# EAGLE design T08-TxClicker-Rev1a (EAGLE 6.4)
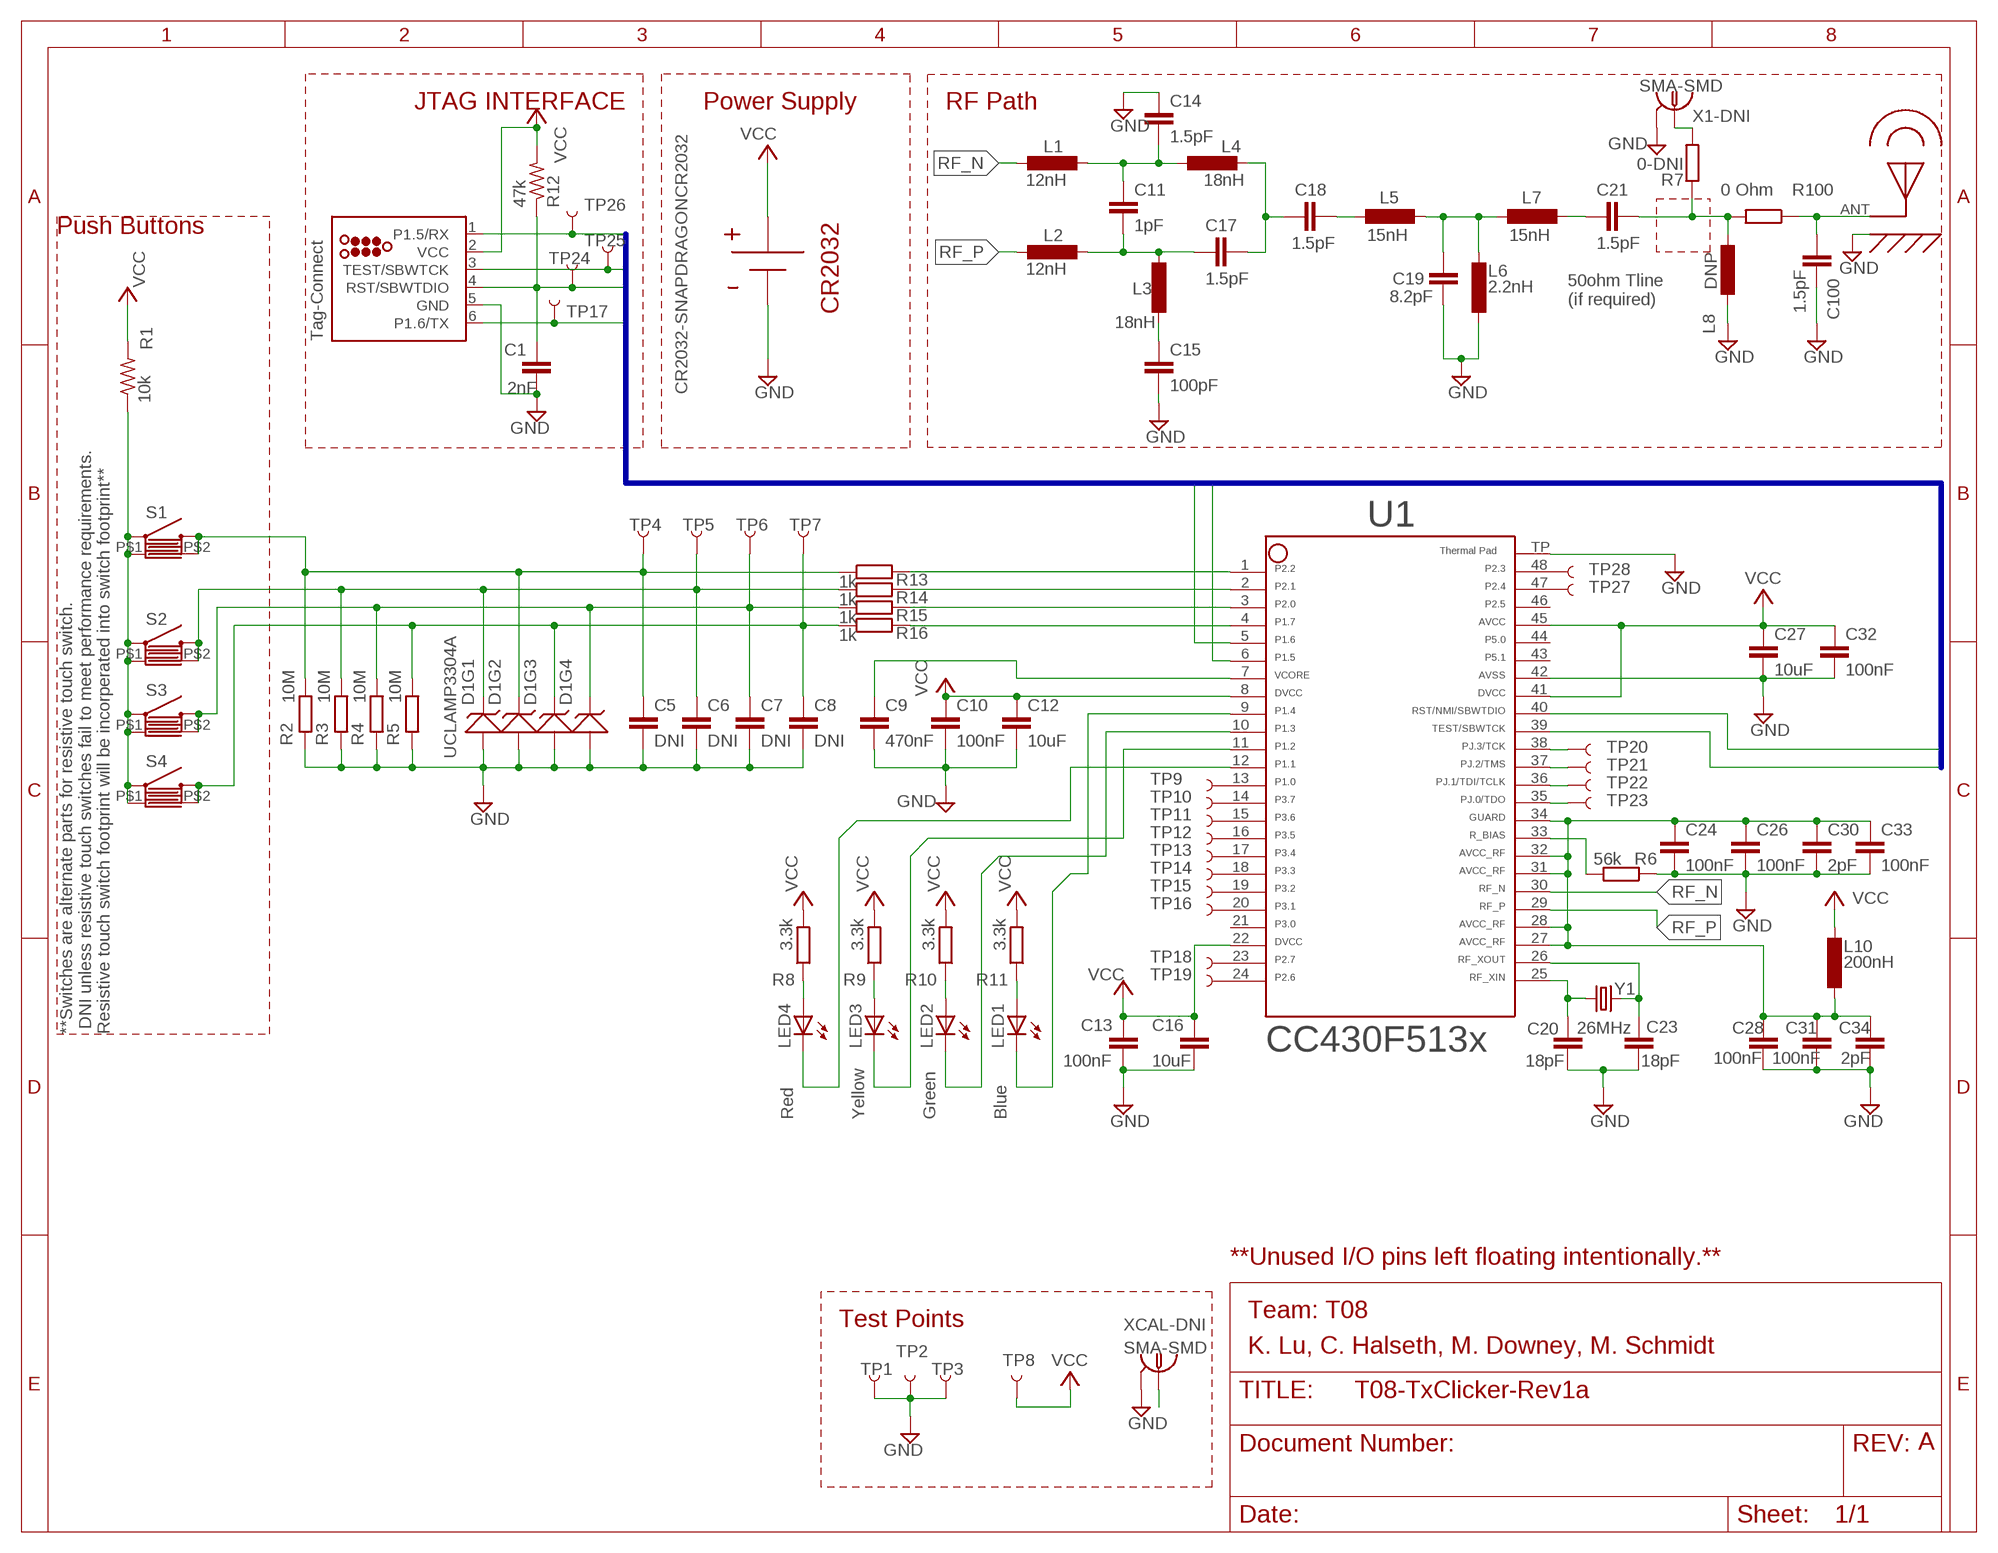
[diagram p0: schematic, sheet 1]

## Parts
C1  2nF  C0603  [C0603]
C5  DNI  C0603  [C0603]
C6  DNI  C0603  [C0603]
C7  DNI  C0603  [C0603]
C8  DNI  C0603  [C0603]
C9  470nF  C0603  [C0603]
C10  100nF  C0603  [C0603]
C11  1pF  C0402  [C0402]
C12  10uF  C0603  [C0603]
C13  100nF  C0603  [C0603]
C14  1.5pF  C0402  [C0402]
C15  100pF  C0402  [C0402]
C16  10uF  C0603  [C0603]
C17  1.5pF  C0402  [C0402]
C18  1.5pF  C0402  [C0402]
C19  8.2pF  C0402  [C0402]
C20  18pF  C0603  [C0603]
C21  1.5pF  C0402  [C0402]
C23  18pF  C0603  [C0603]
C24  100nF  C0603  [C0603]
C26  100nF  C0603  [C0603]
C27  10uF  C0603  [C0603]
C28  100nF  C0603  [C0603]
C30  2pF  C0603  [C0603]
C31  100nF  C0603  [C0603]
C32  100nF  C0603  [C0603]
C33  100nF  C0603  [C0603]
C34  2pF  C0603  [C0603]
C100  1.5pF  C0402  [C0402]
D1  UCLAMP3304A  [SOT666]
L1  12nH  LL0402  [L0402]
L2  12nH  LL0402  [L0402]
L3  18nH  LL0402  [L0402]
L4  18nH  LL0402  [L0402]
L5  15nH  LL0402  [L0402]
L6  2.2nH  LL0402  [L0402]
L7  15nH  LL0402  [L0402]
L8  DNP  LL0402  [L0402]
L10  200nH  LL0603  [L0603]
LED1  Blue  LEDCHIP-LED0603  [CHIP-LED0603]
LED2  Green  LEDCHIP-LED0603  [CHIP-LED0603]
LED3  Yellow  LEDCHIP-LED0603  [CHIP-LED0603]
LED4  Red  LEDCHIP-LED0603  [CHIP-LED0603]
R1  10k  R-US_R0603  [R0603]
R2  10M  R0603  [R0603]
R3  10M  R0603  [R0603]
R4  10M  R0603  [R0603]
R5  10M  R0603  [R0603]
R6  56k  R0603  [R0603]
R7  0-DNI  R0603  [R0603]
R8  3.3k  R0603  [R0603]
R9  3.3k  R0603  [R0603]
R10  3.3k  R0603  [R0603]
R11  3.3k  R0603  [R0603]
R12  47k  R-US_R0603  [R0603]
R13  1k  R0603  [R0603]
R14  1k  R0603  [R0603]
R15  1k  R0603  [R0603]
R16  1k  R0603  [R0603]
R100  0 Ohm  R0402  [R0402]
S1  TOUCHPAD_SWITCH_COMBOSWITC_TOUCHPAD  [TACTILE-PTH-12MM]
S2  TOUCHPAD_SWITCH_COMBOSWITC_TOUCHPAD  [TACTILE-PTH-12MM]
S3  TOUCHPAD_SWITCH_COMBOSWITC_TOUCHPAD  [TACTILE-PTH-12MM]
S4  TOUCHPAD_SWITCH_COMBOSWITC_TOUCHPAD  [TACTILE-PTH-12MM]
TP1  TEST-POINT3  [PAD.03X.03]
TP2  TEST-POINT3  [PAD.03X.03]
TP3  TEST-POINT3  [PAD.03X.03]
TP4  TEST-POINT3  [PAD.03X.03]
TP5  TEST-POINT3  [PAD.03X.03]
TP6  TEST-POINT3  [PAD.03X.03]
TP7  TEST-POINT3  [PAD.03X.03]
TP8  TEST-POINT3  [PAD.03X.03]
TP9  TP9  TEST-POINT3  [PAD.03X.03]
TP10  TEST-POINT3  [PAD.03X.03]
TP11  TEST-POINT3  [PAD.03X.03]
TP12  TEST-POINT3  [PAD.03X.03]
TP13  TEST-POINT3  [PAD.03X.03]
TP14  TEST-POINT3  [PAD.03X.03]
TP15  TEST-POINT3  [PAD.03X.03]
TP16  TEST-POINT3  [PAD.03X.03]
TP17  TEST-POINT3  [PAD.03X.03]
TP18  TEST-POINT3  [PAD.03X.03]
TP19  TEST-POINT3  [PAD.03X.03]
TP20  TEST-POINT3  [PAD.03X.03]
TP21  TEST-POINT3  [PAD.03X.03]
TP22  TEST-POINT3  [PAD.03X.03]
TP23  TEST-POINT3  [PAD.03X.03]
TP24  TEST-POINT3  [PAD.03X.03]
TP25  TEST-POINT3  [PAD.03X.03]
TP26  TEST-POINT3  [PAD.03X.03]
TP27  TEST-POINT3  [PAD.03X.03]
TP28  TEST-POINT3  [PAD.03X.03]
U1  CC430F513X---RGZ48  [RGZ48]
U$1  TC2030-MCP  [TC2030-MCP]
U$5  CR2032-SNAPDRAGONCR2032  [CR2032-SNAPDRAGON]
U$6  PCB_ANTENNA_915MHZOSHP  [PCB_ANTENNA_915MHZ]
X1-DNI  SMA-SMD  [SMA-SMD]
XCAL-DNI  SMA-SMD  [SMA-SMD]
Y1  26MHz  CRYSTALTXC-7A  [CRYSTAL-TXC-7A]

## Nets
ANTENNA: C100.P$2 R100.P$1 U$6.ANT
GND: C1.2 C5.2 C6.2 C7.2 C8.2 C9.2 C10.2 C12.2 C13.2 C14.P$1 C15.P$2 C16.2 C19.P$1 C20.2 C23.2 C24.2 C26.2 C27.2 C28.2 C30.2 C31.2 C32.2 C33.2 C34.2 C100.P$1 D1.2 D1.5 L6.P$2 L8.P$1 R2.1 R3.1 R4.1 R5.1 R6.1 TP1.P$1 TP2.P$1 TP3.P$1 U1.42 U1.TP U$1.5(GND) U$5.V- U$6.GPLANE(GND) X1-DNI.2@1 X1-DNI.2@2 X1-DNI.2@3 X1-DNI.2@4 X1-DNI.2@5 X1-DNI.2@6 XCAL-DNI.2@1 XCAL-DNI.2@2 XCAL-DNI.2@3 XCAL-DNI.2@4 XCAL-DNI.2@5 XCAL-DNI.2@6
N$1: C11.P$2 C17.P$2 L2.P$1 L3.P$1
N$2: C11.P$1 C14.P$2 L1.P$1 L4.P$2
N$3: C17.P$1 C18.P$1 L4.P$1
N$4: C15.P$1 L3.P$2
N$5: C18.P$2 L5.P$1
N$6: C19.P$2 L5.P$2 L6.P$1 L7.P$1
N$7: R16.2 U1.4
N$8: C21.P$2 L7.P$2
N$9: R15.2 U1.3
N$10: LED2.C U1.10
N$11: R1.1 S1.1(BASE) S1.P$1(BASE) S2.1(BASE) S2.P$1(BASE) S3.1(BASE) S3.P$1(BASE) S4.1(BASE) S4.P$1(BASE)
N$12: C21.P$1 L8.P$2 R7.1 R100.P$2
N$13: LED4.A R8.1
N$14: LED3.A R9.1
N$15: LED3.C U1.11
N$16: LED2.A R10.1
N$17: LED1.A R11.1
N$18: LED4.C U1.12
N$19: R14.2 U1.2
N$20: R13.2 U1.1
N$21: TP13.P$1 U1.17
N$22: TP9.P$1 U1.13
N$23: TP10.P$1 U1.14
N$24: TP11.P$1 U1.15
N$25: TP12.P$1 U1.16
N$26: TP14.P$1 U1.18
N$27: TP15.P$1 U1.19
N$28: TP16.P$1 U1.20
N$30: TP18.P$1 U1.23
N$31: TP19.P$1 U1.24
N$35: TP27.P$1 U1.47
N$36: TP28.P$1 U1.48
P1.4: LED1.C U1.9
P1.5/RX: TP26.P$1 U1.6 U$1.1(P1.5/RX)
P1.6/TX: TP17.P$1 U1.5 U$1.6(P1.6/TX)
P1.7: C8.1 D1.4 R5.2 R16.1 S4.3(TOP) S4.P$2(TOP) TP7.P$1
P2.0: C7.1 D1.6 R4.2 R15.1 S3.3(TOP) S3.P$2(TOP) TP6.P$1
P2.1: C6.1 D1.1 R3.2 R14.1 S2.3(TOP) S2.P$2(TOP) TP5.P$1
P2.2: C5.1 D1.3 R2.2 R13.1 S1.3(TOP) S1.P$2(TOP) TP4.P$1
PJ.0/TDO: TP23.P$1 U1.35
PJ.1/TDI/TCLK: TP22.P$1 U1.36
PJ.2/TMS: TP21.P$1 U1.37
PJ.3/TCK: TP20.P$1 U1.38
R_BIAS: R6.2 U1.33
RF_N: L1.P$2 U1.30
RF_P: L2.P$2 U1.29
RF_PWR: C24.1 C26.1 C28.1 C30.1 C31.1 C33.1 C34.1 L10.2 U1.27 U1.28 U1.31 U1.32 U1.34
RF_TEST_50OHM: R7.2 X1-DNI.1
RF_XIN: C20.1 U1.25 Y1.P$1
RF_XOUT: C23.1 U1.26 Y1.P$2
RST/NMI/SBWTDIO: C1.1 R12.1 TP24.P$1 U1.40 U$1.4(RST/SBWTDIO)
TEST50: XCAL-DNI.1
TEST/SBWTCK: TP25.P$1 U1.39 U$1.3(TEST/SBWTCK)
VCC: C10.1 C12.1 C13.1 C16.1 C27.1 C32.1 L10.1 R1.2 R8.2 R9.2 R10.2 R11.2 R12.2 TP8.P$1 U1.8 U1.22 U1.41 U1.45 U$1.2(VCC) U$5.V+
VCORE: C9.1 U1.7
Unconnected: U1.21 U1.43 U1.44 U1.46

## Buses
P1.5/RX,TEST/SBWTCK,RST/NMI/SBWTDIO,P1.6/TX

## Notes on the sheet
- JTAG INTERFACE | Power Supply | RF Path
- Push Buttons
- 50ohm Tline
  (if required)
- CR2032
- Tag-Connect
- **Switches are alternate parts for resistive touch switch.
   DNI unless resistive touch switches fail to meet performance requirements.
  Resistive touch switch footprint will be incorperated into switch footprint**
- **Unused I/O pins left floating intentionally.**
- Team: T08
- Team: T08 | Team: T08 | Team: T08 | Team: T08
- Test Points
- K. Lu, C. Halseth, M. Downey, M. Schmidt
- A

## Library data of the parts
C1 C5-C21 C23 C24 C26-C28 C30-C34 C100 = rcl-amber:C
D1 = Semtech-TVS_Diode:UCLAMP3304A
L1-L8 L10 = rcl-amber:L
LED1-LED4 = adafruit:LED: LED OSRAM: - CHIPLED LG R971, LG N971, LY N971, LG Q971, LY Q971, LO R971, LY R971 LH N974, LH R974 LS Q976, LO Q976, LY Q976 LO Q996 - Hyper CHIPLED LW Q18S LB Q993, LB Q99A, LB R99A - SideLED LS A670, LO A670, LY A670, LG A670, LP A670 LB A673, LV A673, LT A673, LW A673 LH A674 LY A675 LS A676, LA A676, LO A676, LY A676, LW A676 LS A679, LY A679, LG A679 - Hyper Micro SIDELED® LS Y876, LA Y876, LO Y876, LY Y876 LT Y87S - SmartLED LW L88C, LW L88S LB L89C, LB L89S, LG L890 LS L89K, LO L89K, LY L89K LS L896, LA L896, LO L896, LY L896 - TOPLED LS T670, LO T670, LY T670, LG T670, LP T670 LSG T670, LSP T670, LSY T670, LOP T670, LYG T670 LG T671, LOG T671, LSG T671 LB T673, LV T673, LT T673, LW T673 LH T674 LS T676, LA T676, LO T676, LY T676, LB T676, LH T676, LSB T676, LW T676 LB T67C, LV T67C, LT T67C, LS T67K, LO T67K, LY T67K, LW E67C LS E67B, LA E67B, LO E67B, LY E67B, LB E67C, LV E67C, LT E67C LW T67C LS T679, LY T679, LG T679 LS T770, LO T770, LY T770, LG T770, LP T770 LB T773, LV T773, LT T773, LW T773 LH T774 LS E675, LA E675, LY E675, LS T675 LS T776, LA T776, LO T776, LY T776, LB T776 LHGB T686 LT T68C, LB T68C - Hyper Mini TOPLED® LB M676 - Mini TOPLED Santana® LG M470 LS M47K, LO M47K, LY M47K Source: http://www.osram.convergy.de/
R1 R12 = rcl:R-US_: RESISTOR, American symbol
R2-R11 R13-R16 R100 = rcl-amber:R
S1-S4 = button_TestFootprint:TOUCHPAD_SWITCH_COMBO: Closed Switch for tutorial schematics. Not intended for PCB design. Maps to 12mm tact switch, only because eagle won't place a part with no package defined. The ordinary SWITCH-MOMENTARY-2 is likely to be more useful for regular schematics.
TP1-TP28 = SparkFun-Passives:TEST-POINT: Bare copper test points for troubleshooting or ICT
U1 = CC430F5xxx_pinmod:CC430F513X---RGZ48: ***CC430F513X***RGZ48 ** ** Rev 1.0 ** 06/2010 * http://focus.ti.com/docs/prod/folders/print/cc430f5137.html
U$1 = tagConnect:TC2030: TAG-CONNECT ISP Connector Manufacturer: Tag-Connect <www.tag-connect.com> Cable for easy In-Circuit PCB Programming. Designed for Microchip ICD2, suitable for many others. Two variants - one "with legs" (for hads-free fit on PCB) and another "without legs" for quick programming. PAD Description 1 MCLR/Vpp 2 Vdd 3 GND 4 PGD (ISPDAT) 5 PGC (ISPCLK) 6 nc (used for LVP) ©2009 ROFA.cz
U$5 = CR2032-SnapDragon:CR2032-SNAPDRAGON: HOLDER SNAP DRAGON CR2032 SMD Digikey P/N: BHSD-2032-SMCT-ND
U$6 = PCB_Antenna_915MHz-halseth:PCB_ANTENNA_915MHZ
X1-DNI XCAL-DNI = con-coax:SMA-SMD: SMA 50 Ohm Straight Jack Receptacle - Surface Mount www.johnsoncomponents.com Source: http://catalog.digikey.com .. 142-0711-201, 205, 202, 206.pdf; OC_FARNELL: unknown; OC_NEWARK: unknown
Y1 = SparkFun-FreqCtrl:CRYSTAL: Various standard crystals. Proven footprints. Spark Fun Electronics SKU : COM-00534

## Board
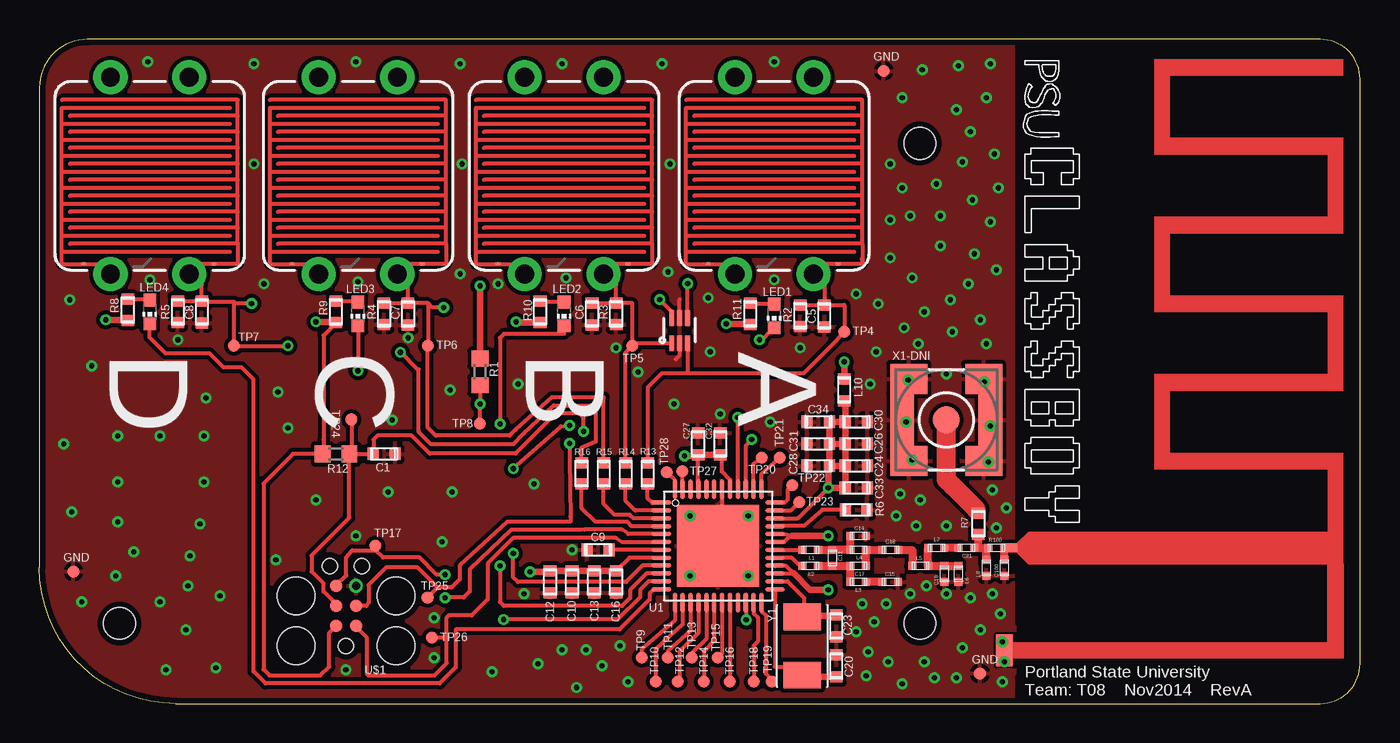
[diagram p1: board, top side]
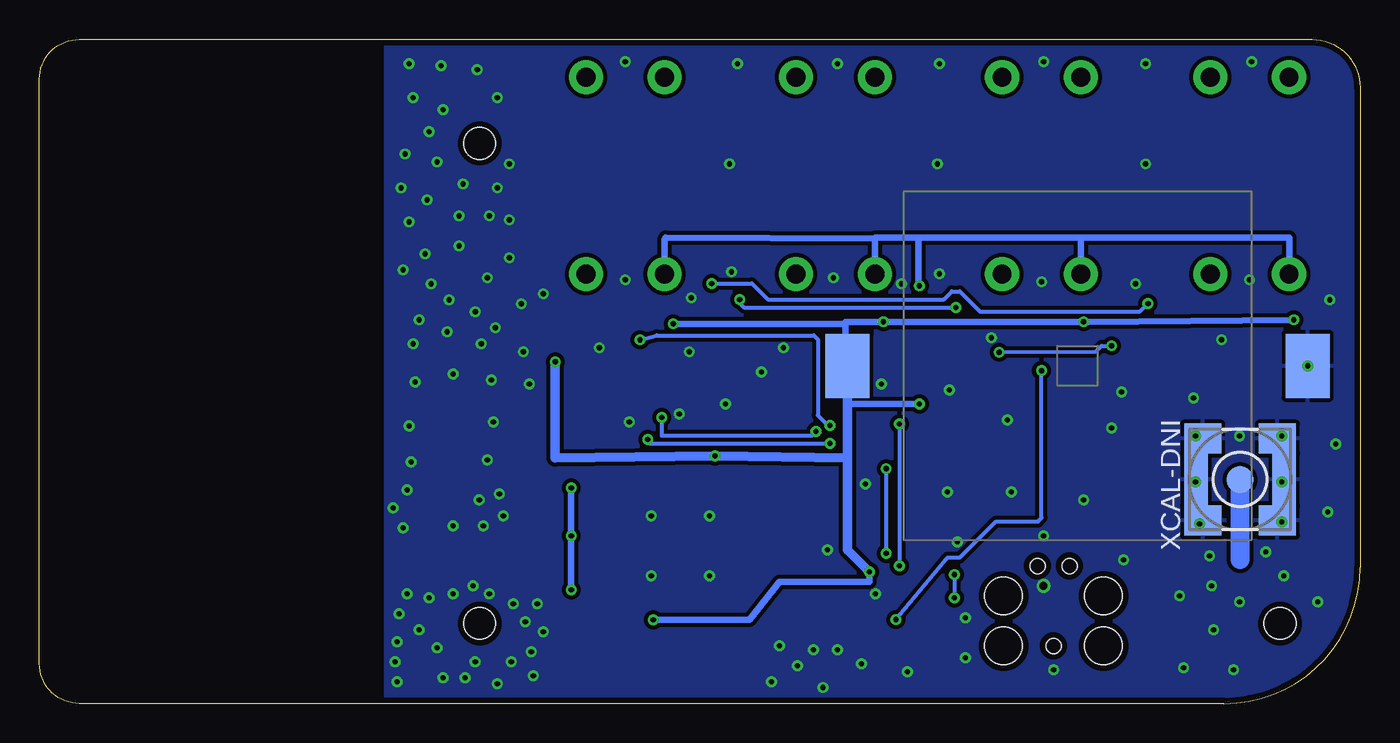
[diagram p2: board, bottom side, seen from below]

Size 83.82 x 42.16 mm. Coordinates in mm from the lower left corner, seen from the top.
Outline: 8.64,0 81.28,0 arc90 83.82,2.54 83.82,39.62 arc90 81.28,42.16 3.05,42.16 arc90 0,39.12 0,8.64 arc90 8.64,0
Copper layers (1*16): Top 0.0356mm / dielectric 1.5011mm / Bottom 0.0356mm
Design rules "OSH-Park-2-layer *": minimum track width 6mil, minimum drill 13mil, track to track 6mil, track to pad 6mil, pad to pad 6mil, via to via 6mil, smd to smd 0mil, copper to edge 15mil, drill to drill 6mil, minimum pad ring 7mil, minimum via ring 7mil, stop-mask expansion 3mil, vias tented up to drill 0mil, thermal gap 10mil
Holes 2 mm at 55.88,35.56 55.88,5.08 5.08,5.08

### Footprints (pad centres in the part's own frame; a part is rotated, then mirrored left to right if it is on the bottom)
C0603 = smd 0.7 x 0.8: 1 -0.7,0; 2 0.7,0
C0402 = smd 0.5 x 0.5: P$1 -0.5,0; P$2 0.5,0
SOT666 = smd 0.3 x 0.99: 1 0,0; 2 0.5,0; 3 1,0; 4 1,1.61; 5 0.5,1.61; 6 0,1.61
L0402 = smd 0.5 x 0.5: P$1 -0.5,0; P$2 0.5,0
L0603 = smd 0.7 x 0.8: 1 -0.7,0; 2 0.7,0
CHIP-LED0603 = smd 0.8 x 0.8: A 0,-0.75; C 0,0.75
R0603 = smd 1 x 1.1: 1 -0.85,0; 2 0.85,0
R0603' = smd 0.7 x 0.8: 1 -0.675,0; 2 0.675,0
R0402 = smd 0.5 x 0.5: P$1 -0.5,0; P$2 0.5,0
TACTILE-PTH-12MM = drill 1.2 pad 2.159: 1 6.25,-2.5; 2 -6.25,-2.5; 3 6.25,2.5; 4 -6.25,2.5 | smd 0.152 x 0.305: P$1 5.588,-4.191; P$2 5.588,4.064
PAD.03X.03 = smd 0.762 x 0.762: P$1 0,0
RGZ48 = smd 1.27 x 0.3: 1 -3.604,2.75; 2 -3.604,2.25; 3 -3.604,1.75; 4 -3.604,1.25; 5 -3.604,0.75; 6 -3.604,0.25; 7 -3.604,-0.25; 8 -3.604,-0.75; 9 -3.604,-1.25; 10 -3.604,-1.75; 11 -3.604,-2.25; 12 -3.604,-2.75; 25 3.604,-2.75; 26 3.604,-2.25; 27 3.604,-1.75; 28 3.604,-1.25; 29 3.604,-0.75; 30 3.604,-0.25; 31 3.604,0.25; 32 3.604,0.75; 33 3.604,1.25; 34 3.604,1.75; 35 3.604,2.25; 36 3.604,2.75 | smd 0.3 x 1.27: 13 -2.75,-3.604; 14 -2.25,-3.604; 15 -1.75,-3.604; 16 -1.25,-3.604; 17 -0.75,-3.604; 18 -0.25,-3.604; 19 0.25,-3.604; 20 0.75,-3.604; 21 1.25,-3.604; 22 1.75,-3.604; 23 2.25,-3.604; 24 2.75,-3.604; 37 2.75,3.604; 38 2.25,3.604; 39 1.75,3.604; 40 1.25,3.604; 41 0.75,3.604; 42 0.25,3.604; 43 -0.25,3.604; 44 -0.75,3.604; 45 -1.25,3.604; 46 -1.75,3.604; 47 -2.25,3.604; 48 -2.75,3.604 | smd 5.2 x 5.2: TP 0,0
TC2030-MCP = smd 0.787 x 0.787: 1 1.27,-0.635; 2 1.27,0.635; 3 2.54,-0.635; 4 2.54,0.635; 5 3.81,-0.635; 6 3.81,0.635 | hole 0.95: 0,0; 5.08,-1.016; 5.08,1.016 | hole 2.375: 0,3.175; 0,-3.175; 3.175,-3.175; 3.175,3.175
CR2032-SNAPDRAGON = smd 2.794 x 4.064: V+ 14.605,0; V- -14.605,0
PCB_ANTENNA_915MHZ = smd 0.5 x 1: ANT 0,-1.17 | smd 2 x 1: GPLANE 6.51,-1.5
SMA-SMD = smd 1.73 x 1.73: 1 0,0 | smd 2.35 x 1.9: 2@1 -2.375,2.6; 2@2 -2.375,-2.6; 2@3 2.375,-2.6; 2@4 2.375,2.6 | smd 1.5 x 3.4: 2@5 -2.8,0; 2@6 2.8,0
CRYSTAL-TXC-7A = smd 1.7 x 2.4: P$1 1.85,0; P$2 -1.85,0

### Placement (x,y rotation side)
C1  21.87,15.85 0 top
C5  49.81,24.61 270 top
C6  35.08,24.74 270 top
C7  23.39,24.74 270 top
C8  10.31,24.87 270 top
C9  35.46,9.75 180 top
C10  33.81,7.72 270 top
C11  50.32,9.25 270 top
C12  32.41,7.72 270 top
C13  35.2,7.72 270 top
C14  51.97,10.64 180 top
C15  54,7.72 0 top
C16  36.6,7.72 270 top
C17  51.97,8.74 180 top
C18  54,9.75 0 top
C19  57.43,8.23 90 top
C20  50.57,2.39 90 top
C21  58.83,9.88 180 top
C23  50.57,4.93 270 top
C24  51.84,15.09 0 top
C26  51.84,16.48 0 top
C27  41.81,16.48 90 top
C28  49.43,15.09 180 top
C30  51.84,17.88 0 top
C31  49.43,16.48 180 top
C32  43.21,16.48 90 top
C33  51.84,13.69 0 top
C34  49.43,17.88 180 top
C100  61.24,8.61 90 top
D1  40.13,22.86 0 top
L1  48.92,9.75 180 top
L2  48.92,8.74 180 top
L3  51.97,7.72 0 top
L4  51.97,9.75 180 top
L5  55.91,8.74 0 top
L6  58.32,8.23 270 top
L7  56.92,9.88 0 top
L8  60.1,8.61 90 top
L10  51.08,19.91 270 top
LED1  46.63,24.61 180 top
LED2  33.3,24.74 180 top
LED3  20.22,24.74 180 top
LED4  7.01,24.87 180 top
R1  27.97,21.06 270 top
R2  10M  [R0603']  48.29,24.61 90 top
R3  10M  [R0603']  36.6,24.74 90 top
R4  10M  [R0603']  21.87,24.74 90 top
R5  10M  [R0603']  8.79,24.87 90 top
R6  56k  [R0603']  51.84,12.29 180 top
R7  0-DNI  [R0603']  59.59,11.4 90 top
R8  3.3k  [R0603']  5.61,24.99 270 top
R9  3.3k  [R0603']  18.82,24.87 270 top
R10  3.3k  [R0603']  31.78,24.87 270 top
R11  3.3k  [R0603']  45.11,24.74 270 top
R12  18.82,15.85 180 top
R13  1k  [R0603']  38.61,14.61 270 top
R14  1k  [R0603']  37.21,14.61 270 top
R15  1k  [R0603']  35.81,14.61 270 top
R16  1k  [R0603']  34.42,14.61 270 top
R100  60.73,9.88 180 top
S1  46.63,33.5 270 top
S2  33.3,33.5 270 top
S3  20.22,33.5 270 top
S4  7.01,33.5 270 top
TP1  53.57,40.16 270 top
TP2  2.16,8.38 270 top
TP3  59.69,1.91 270 top
TP4  51.08,23.6 270 top
TP5  37.64,22.71 270 top
TP6  24.66,22.71 270 top
TP7  12.34,22.71 270 top
TP8  27.97,17.75 270 top
TP9  38.23,2.92 270 top
TP10  39.12,1.4 270 top
TP11  39.88,2.92 270 top
TP12  40.51,1.4 270 top
TP13  41.4,2.92 270 top
TP14  42.16,1.4 270 top
TP15  43.05,2.92 270 top
TP16  43.81,1.4 270 top
TP17  21.34,10.03 0 top
TP18  45.34,1.4 270 top
TP19  46.48,1.4 270 top
TP20  45.85,15.62 270 top
TP21  46.99,15.62 270 top
TP22  47.78,13.87 270 top
TP23  48.21,12.78 270 top
TP24  19.81,18.03 0 top
TP25  24.64,6.73 0 top
TP26  24.89,4.19 0 top
TP27  40.79,14.76 270 top
TP28  39.83,14.68 270 top
U1  43.08,10.01 0 top
U$1  19.46,3.66 90 top
U$5  17.93,21.44 180 bottom
U$6  62.75,9.88 270 top
X1-DNI  57.56,18.01 0 top
XCAL-DNI  7.62,14.22 0 bottom
Y1  48.41,3.66 270 top

### Tracks (layer width: path | path; a pad name or v marks a point on that pad's centre or on a via)
ANTENNA
  Top 0.508: C100.P$2 R100.P$1 U$6.ANT
GND  (via drill 0.33, 0.51)
  Top 0.254: U1.42 43.33,9.12 | 43.33,9.12 U1.TP | 40.64,25.65 D1.5 | 40.39,21.84 40.64,22.1 D1.2 | v44.98,8.1 44.34,8.1 43.33,9.12
  other vias: 34.09,1.02 41.3,11.91 44.98,11.91 41.3,8.1 25.04,2.9 25.04,5.44 15.01,9.12 19.46,2.13 38,21.06 29.11,26.64 25.55,10.26 31.39,13.94 33.81,9.75 36.6,22.58 23.39,23.22 8.79,23.09 3.33,21.44 20.09,7.47 30.76,6.96 43.21,18.39 39.9,27.41 48.29,22.58 60.35,40.61 58.32,40.49 56.03,40.23 54.76,38.46 58.19,37.69 60.1,38.46 60.6,34.9 58.57,34.39 59.08,36.3 60.35,30.58 59.21,31.98 55.27,30.96 54.76,32.74 56.92,32.99 57.18,29.06 59.33,28.55 58.95,26.64 60.73,27.53 55.4,27.03 53.24,25.37 54,28.3 57.18,30.96 60.86,32.74 54,34.26 54,30.71 57.81,25.63 56.16,24.87 54.89,23.85 57.94,23.6 59.72,24.36 60.1,22.83 55.78,22.83 53.11,22.33 52.73,20.29 51.84,26.01 55.14,20.55 59.97,20.42 60.22,15.34 60.35,17.63 55.4,15.47 55.02,17.88 57.56,20.93 55.91,12.93 54.64,13.31 54.38,11.91 55.65,11.28 57.56,11.28 60.48,13.56 61.37,12.42 60.73,11.15 59.08,6.71 60.48,6.96 56.29,7.47 55.27,6.96 53.75,6.32 52.22,6.32 46.38,17.88 40.28,19.02 42.57,22.33 42.44,25.76 46.63,26.9 33.43,27.03 20.22,26.77 39.52,40.61 46.63,40.74 40.03,34.26 33.17,40.61 26.7,40.61 26.82,34.26 20.09,40.74 13.61,40.61 6.88,40.74 1.93,25.63 1.55,16.48 4.98,16.99 4.98,14.07 4.98,11.53 10.19,11.4 10.44,14.07 10.44,16.99 7.65,16.99 10.57,19.41 15.14,19.79 17.55,12.93 22.12,13.44 26.06,19.91 28.73,2.01 31.65,2.51 11.2,2.26 11.46,6.83 9.3,4.67 9.55,9.37 4.85,8.1 5.99,9.63 7.65,6.45 9.42,7.47 2.06,12.17 8.03,2.13 15.77,17.5 22.38,18.01 30.38,20.29 14.25,26.64 26.7,27.28 7.01,26.9 13.61,34.26 52.98,5.18 52.6,3.28 52.48,1.75 53.87,2.64 56.79,1.63 54.76,1.24 56.16,2.64 58.57,3.53 59.72,4.67 61.11,1.37 58.19,1.63 57.56,6.96 61.11,3.91 61.24,2.64 60.99,5.69 34.7,3.4 33.17,3.4 35.71,2.39 20.09,10.64 51.84,4.55 37.36,1.37 2.69,6.45 26.19,13.44 36.86,3.66
  pour Bottom (isolate 0.254): 0,0 61.82,0 61.82,42.16 0,42.16
  pour Top (isolate 0.254): 61.82,0 61.82,42.16 0,42.16 0,0
  pour Top (no thermals): 60.48,4.93 61.87,4.93 61.87,1.88 60.48,1.88
N$1
  Top 0.508: L3.P$1 C17.P$2 C11.P$2 50.32,8.74 L2.P$1
N$2
  Top 0.508: C14.P$2 L4.P$2 50.45,9.75 C11.P$1 50.44,9.75 L1.P$1
N$3
  Top 0.508: C18.P$1 L4.P$1 C17.P$1
N$4
  Top 0.508: C15.P$1 L3.P$2
N$5
  Top 0.508: C18.P$2 55.41,9.75 L5.P$1
N$6
  Top 0.508: L7.P$1 56.41,9.87 L5.P$2 C19.P$2 L6.P$1
N$7
  Top 0.254: U1.4 37.59,11.26 37.31,11.53 35.28,11.53 34.42,12.39 R16.2
N$8
  Top 0.508: C21.P$2 L7.P$2
N$9
  Top 0.254: U1.3 37.7,11.76 37.47,11.99 36.5,11.99 35.81,12.68 R15.2
N$10  (via drill 0.33)
  Top 0.254: U1.10 38.53,8.26 37.49,7.21 37.49,6.71 36.98,6.2 29.49,6.2 29.23,6.45 v29.23,8.74 | LED2.C 33.3,23.47 29.49,23.47 29.23,23.22 v29.23,17.75
  Bottom 0.254: v29.23,17.75 v29.23,8.74
N$11  (via drill 0.33)
  Top 0.254: v27.96,26.52 27.74,26.52 | S4.P$1 3.85,27.91 S4.1 | S1.P$1 43.47,27.91 S1.1 | S3.P$1 17.06,27.91 S3.1 | S2.P$1 30.14,27.91 S2.1
  Top 0.406: R1.1 v27.96,26.52
  Bottom 0.254: v27.96,26.52 28.02,26.52
  Bottom 0.406: S2.1 30.8,29.53 | 30.8,29.53 30.76,29.57 28.02,29.57 | 17.72,29.48 17.8,29.57 | 30.8,29.53 44.09,29.57 44.13,29.44 S1.1 | 4.51,29.57 S4.1 4.5,27.38 4.5,29.57 17.72,29.57 | 28.02,26.52 28.02,29.57 | 17.8,29.57 17.72,29.57 | 17.72,29.57 S3.1 | 28.02,29.57 17.8,29.57
N$12
  Top 0.508: L8.P$2 60.1,9.75 R100.P$2 59.59,9.88 | C21.P$1 59.59,9.88 | 59.59,9.88 R7.1
N$13
  Top 0.254: R8.1 6.96,25.67 LED4.A
N$14
  Top 0.254: R9.1 20.34,25.54 LED3.A
N$15  (via drill 0.33)
  Top 0.254: U1.11 38.67,7.76 38.12,7.21 38.12,6.76 36.7,5.33 v29.46,5.33 | LED3.C v20.22,21.13
  Bottom 0.254: v29.46,5.33 26.29,9.14 26.16,9.27 25.4,9.27 23.11,11.56 20.45,11.56 20.22,11.79 v20.22,21.13
N$16
  Top 0.254: LED2.A 31.83,25.49 R10.1
N$17
  Top 0.254: LED1.A 45.16,25.36 R11.1
N$18
  Top 0.254: U1.12 39.01,7.26 38.73,6.99 38.73,6.6 36.83,4.7 26.42,4.7 26.42,2.29 25.4,1.27 14.35,1.27 13.59,2.03 13.59,20.57 12.83,21.34 11.68,21.34 10.79,22.23 8,22.23 6.99,23.24 6.99,24.09 LED4.C
N$19
  Top 0.254: U1.2 37.81,12.26 37.21,12.85 R14.2
N$20
  Top 0.254: U1.1 38.91,12.73 38.61,13.03 R13.2
N$21
  Top 0.254: U1.17 42.33,4.1 41.4,3.17 TP13.P$1
N$22
  Top 0.254: U1.13 40.33,5.28 38.23,3.43 TP9.P$1
N$23
  Top 0.254: U1.14 40.83,5.01 39.12,3.43 TP10.P$1
N$24
  Top 0.254: U1.15 41.33,4.62 39.88,3.3 TP11.P$1
N$25
  Top 0.254: U1.16 41.83,4.49 40.64,3.3 40.64,1.52 TP12.P$1
N$26
  Top 0.254: U1.18 42.83,3.97 42.16,3.3 TP14.P$1
N$27
  Top 0.254: U1.19 43.33,3.2 TP15.P$1
N$28
  Top 0.254: U1.20 43.83,1.41 TP16.P$1
N$30
  Top 0.254: U1.23 45.33,5.73 45.59,5.46 45.59,3.94 45.34,3.68 TP18.P$1
N$31
  Top 0.254: U1.24 45.83,5.86 46.1,5.59 46.1,1.91 TP19.P$1
N$35
  Top 0.254: U1.47 40.83,14.72 TP27.P$1
N$36
  Top 0.254: U1.48 40.33,14.18 TP28.P$1
P1.4  (via drill 0.33)
  Top 0.254: U1.9 38.27,8.76 37.24,7.72 30.38,7.72 30.07,8 v30.07,9.53 | v45.7,23.09 45.7,22.92 LED1.C | v30.07,14.91 33.1,17.6 v33.66,17.65
  Bottom 0.254: v30.07,9.53 v30.07,14.91 | v45.7,23.09 44.65,23.37 34.67,23.37 34.42,23.11 34.42,18.29 33.78,17.65 v33.66,17.65
P1.5/RX
  Top 0.254: U1.6 36.99,10.26 36.6,10.52 30.07,10.52 28.45,8.89 28.45,6.6 27.43,5.59 25.98,5.59 25.86,5.46 25.86,4.19 | U$1.1 20.09,4.88 20.78,4.19 20.78,1.88 20.88,1.78 25.07,1.78 25.86,2.56 25.86,4.19 | TP26.P$1 25.86,4.19
P1.6/TX  (via drill 0.33)
  Top 0.254: U1.5 37.38,10.76 36.98,11.05 34.59,11.05 34.37,11.02 29.95,11.02 27.3,8.51 27.3,7.11 26.92,6.73 25.78,6.73 v25.76,6.71 | U$1.6 18.82,7.54 19.48,8.13 19.48,9.27 19.86,9.73 21.34,9.73 | TP17.P$1 21.34,9.74 21.34,9.73 | v25.76,8.18 25.22,8.18 24.13,9.27 21.8,9.27 21.34,9.73
  Bottom 0.254: v25.76,8.18 v25.76,6.71
P1.7  (via drill 0.33)
  Top 0.254: R5.2 10.29,25.54 C8.1 | C8.1 10.31,26.58 S4.3 10.17,27.91 S4.P$2 | 12.34,25.4 12.34,25.5 10.31,25.5 C8.1 | 12.34,25.4 TP7.P$1 v15.77,22.71 | 12.57,29.29 12.6,29.18 | R16.1 34.42,16.26 35.31,16.64 35.31,18.92 32.64,18.92 30.73,17.14 30.05,16.46 24.87,16.46 24.08,17.25 24.08,21.21 24,21.21 v22.91,22.3 | D1.4 41.13,24.4 41.15,24.38 v41.15,26.67 | v13.46,25.4 12.34,25.4
  Bottom 0.254: v22.91,22.3 16.76,22.35 16.41,22.71 v15.77,22.71 | v41.15,26.67 38.61,26.67 37.59,25.65 26.42,25.65 25.91,26.16 25.4,26.16 24.13,24.89 13.97,24.89 v13.46,25.4
P2.0  (via drill 0.33)
  Top 0.254: R4.2 23.37,25.41 C7.1 | C7.1 23.39,26.7 S3.3 23.38,27.91 S3.P$2 | 24.66,25.41 TP6.P$1 24.64,22.68 24.64,17.53 25.15,17.02 29.84,17.02 30.23,17.4 32.51,19.43 35.81,19.43 R15.1 | 24.66,25.41 23.39,25.41 C7.1 | D1.6 40.13,24.89 v39.37,25.65 | v25.65,25.15 24.93,25.15 24.66,25.41
  Bottom 0.254: v39.37,25.65 39.37,25.4 39.12,25.15 v25.65,25.15
P2.1
  Top 0.254: C6.1 36.58,25.44 R3.2 | R3.2 36.6,26.58 S2.3 36.46,27.91 S2.P$2 | TP5.P$1 37.64,25.41 R3.2 | 38.89,28.47 38.89,27.91 | R14.1 37.21,22.28 TP5.P$1 | D1.1 37.8,22.86 TP5.P$1
P2.2
  Top 0.254: R2.2 49.81,25.29 C5.1 | C5.1 51.08,25.31 TP4.P$1 50.24,22.71 48.51,20.98 41.15,20.98 | 41.15,20.98 39.52,20.98 38.61,20.07 R13.1 | C5.1 49.81,26.58 S1.3 49.8,27.91 S1.P$2 | 52.2,28.25 52.2,27.94 52.22,27.91 | D1.3 41.13,21 41.15,20.98
PJ.0/TDO
  Top 0.254: U1.35 47.69,12.26 TP23.P$1
PJ.1/TDI/TCLK
  Top 0.254: U1.36 47.3,12.76 47.5,12.95 47.5,13.59 TP22.P$1
PJ.2/TMS
  Top 0.254: U1.37 45.83,14.59 TP21.P$1
PJ.3/TCK
  Top 0.254: U1.38 45.33,15.23 TP20.P$1
R_BIAS
  Top 0.254: 51.15,12.27 R6.2 49.68,12.29 48.54,11.28 46.7,11.28 U1.33
RF_N
  Top 0.152: L1.P$2
  Top 0.254: U1.30 L1.P$2
RF_P
  Top 0.254: L2.P$2 48.28,8.74 47.78,9.25 46.44,9.25 U1.29
RF_PWR  (via drill 0.33)
  Top 0.254: 50.19,17.94 C34.1 | U1.34 48.13,11.76 v50.06,13.69 | U1.31 47.27,10.26 47.52,10.52 47.78,10.64 | U1.32 47.28,10.76 47.9,10.64 | U1.27 47.88,8.26 47.4,8.74 46.7,8.74 U1.28 | C24.1 51.08,15.09
  Top 0.406: C30.1 C26.1 | C26.1 C24.1 C33.1 | C30.1 51.14,19.15 L10.2 | 47.88,8.26 48.92,7.21 v50.06,7.21 | C30.1 C34.1 C31.1 C28.1 50.06,15.09 v50.06,13.69 51.21,13.69 | v50.06,10.64 47.9,10.64 47.78,10.64 | 51.21,16.48 C26.1 | C26.1 50.06,16.48 | 51.08,15.09 50.19,15.09
  Bottom 0.406: v50.06,13.69 v50.06,10.64 v50.06,7.21
RF_TEST_50OHM
  Top 0.61: R7.2 57.56,14.2 | 57.56,17.75 X1-DNI.1
  Top 1.194: 57.56,17.75 57.56,14.2 57.94,13.84 59.46,12.32
RF_XIN
  Top 0.254: U1.25 46.68,2.34 47.88,2.34 | 48.53,1.69 Y1.P$1
  Top 0.406: 47.88,2.34 Y1.P$1 | C20.1 48.53,1.69
RF_XOUT
  Top 0.254: 48.66,5.75 Y1.P$2 48.54,5.63 48.54,6.71 47.49,7.76 U1.26 46.38,7.76 | C23.1 50.57,5.56
  Top 0.406: 50.57,5.56 48.47,5.56 Y1.P$2
RST/NMI/SBWTDIO  (via drill 0.33)
  Top 0.254: U1.40 v44.33,18.16 v44.32,18.16 | v34.54,17.27 34.54,18.16 34.29,18.41 32.77,18.41 30.23,15.88 24.77,15.88 23.62,17.02 21.46,17.02 21.21,16.76 21.21,15.89 C1.1 R12.1 | U$1.4 18.82,6.33 18.03,7.11 18.03,7.62 17.27,8.38 17.27,9.4 19.67,11.8 R12.1 | 19.56,15.74 R12.1 | TP24.P$1 19.81,15.99 R12.1
  Bottom 0.254: v44.32,18.16 44.32,17.02 34.8,17.02 v34.54,17.27
TEST50
  Bottom 1.194: XCAL-DNI.1 7.62,9.14
TEST/SBWTCK  (via drill 0.33)
  Top 0.254: U$1.3 20.75,6.2 20.88,6.4 20.88,7.52 22,8.64 24,8.64 25.25,7.39 25.25,7.34 | U1.39 44.83,16.38 v45.21,16.76 | v33.66,16.51 33.66,15.47 33.71,11.86 33.71,11.53 29.69,11.53 26.67,8.76 26.67,7.87 26.16,7.37 25.27,7.37 25.25,7.34 | TP25.P$1 25.25,7.34
  Bottom 0.254: v45.21,16.76 45.09,16.51 v33.66,16.51
VCC  (via drill 0.33)
  Top 0.254: U1.8 37.44,9.26 C16.1 | U1.41 43.84,13.36 43.84,14.2 43.31,14.73 43.31,15.51 C32.1 | U1.45 41.81,13.36 C27.1 | U1.22 44.86,6.4 v44.86,5.31 | R1.2 v27.96,19.02 TP8.P$1 | R12.2 16.26,15.85 | U$1.2 18.39,4.5 18.39,2.34 17.83,1.78 14.61,1.78 14.22,2.16 14.22,13.97 16.1,15.85 R12.2 | R12.2 18.03,15.91 18.03,16.38 18.03,16.76 18.03,23.37 18.86,24.19 | R9.2 18.86,24.19 | 18.86,24.19 18.92,24.26
  Top 0.406: C16.1 C13.1 C10.1 C12.1 32.34,8.36 v31.14,8.36 | C32.1 C27.1 41.81,15.72 v40.95,15.72 | L10.1 v51.08,21.69 | v43.59,24.11 45.11,24.11 R11.2 | R10.2 30.42,24.19 v30.25,24.23 | 18.78,24.23 R9.2 18.82,24.23 v17.55,24.23 | R8.2 arc90 5.57,24.36 v4.22,24.36
  Bottom 0.254: 33.43,22.45 33.43,21.57 U$5.V+
  Bottom 0.406: v44.86,5.31 38.76,5.31 36.85,7.72 31.14,7.72 v31.14,8.36 | 33.43,22.45 32.66,22.45 32.66,24.11 | v27.96,19.02 32.54,19.02 | v4.22,24.36 17.3,24.23 v17.55,24.23 v30.25,24.23 32.66,24.23 32.66,24.11 | 32.66,24.11 v43.59,24.11
  Bottom 0.61: 32.54,15.6 32.54,9.75 v31.14,8.36 | U$5.V+ 32.54,19.02 32.54,15.6 | 32.54,15.6 v40.95,15.72 51.08,15.6 v51.08,21.69
VCORE
  Top 0.254: U1.7 36.29,9.76 C9.1

### Text on the board
tPlace: GND | D | C | B | A | GND | GND | Portland State University / Team: T08 Nov2014 RevA